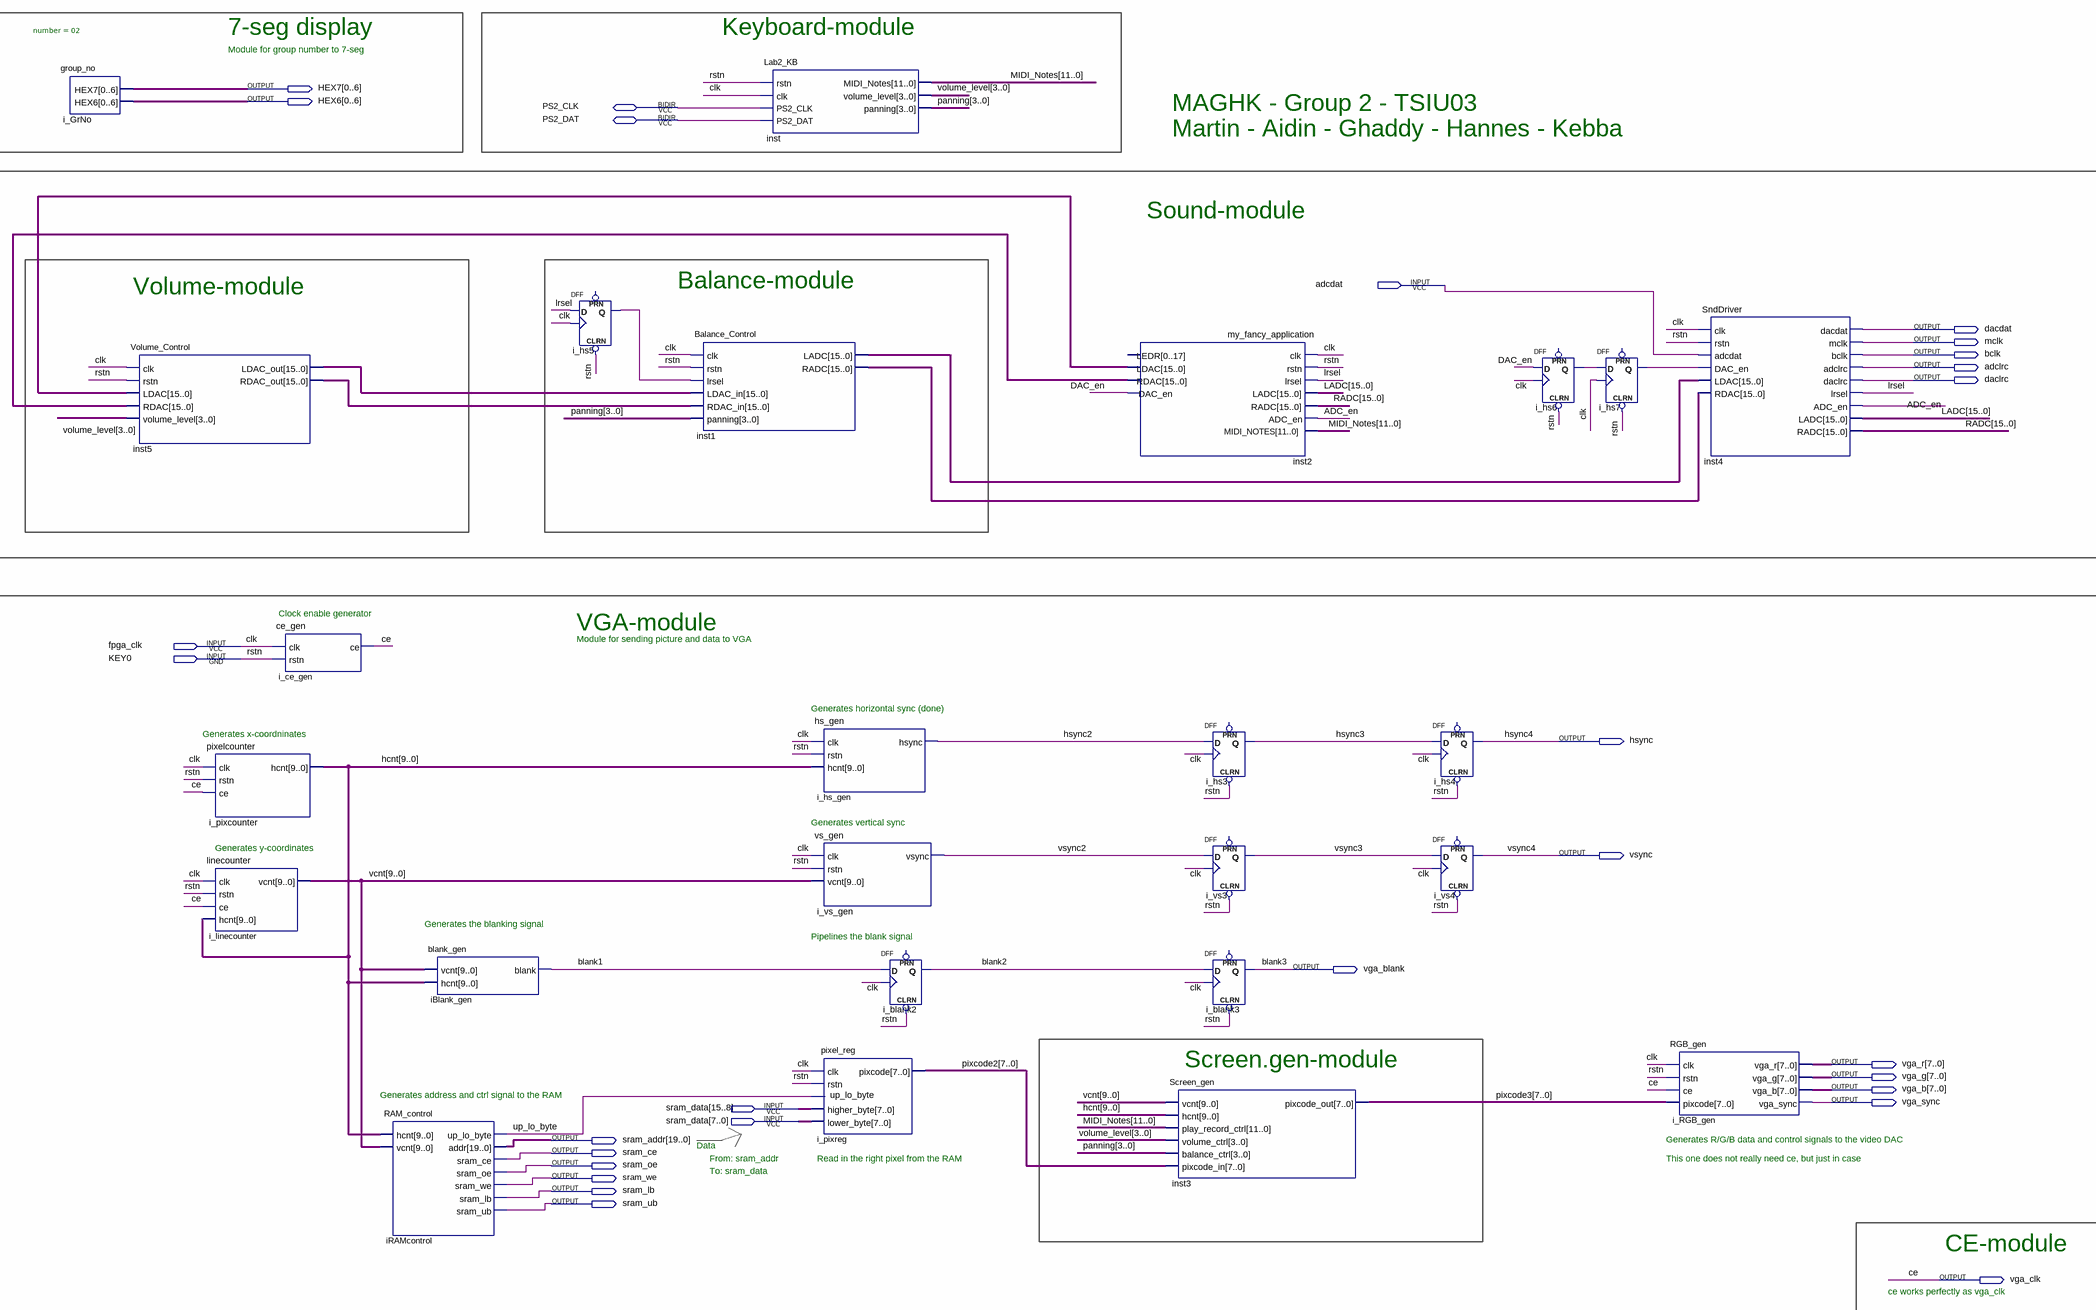
[diagram p0: schematic sheet]
// Quartus schematic VGA_contr.bdf as structural Verilog: 25 symbols, 28 pins
module VGA_contr (
  input  adcdat,
  input  fpga_clk,
  input  KEY0,
  input  [15:0] sram_data,
  inout  PS2_CLK,
  inout  PS2_DAT,
  output [0:6] HEX7,
  output [0:6] HEX6,
  output dacdat,
  output mclk,
  output bclk,
  output adclrc,
  output daclrc,
  output hsync,
  output vsync,
  output vga_blank,
  output [7:0] vga_r,
  output [7:0] vga_g,
  output [7:0] vga_b,
  output vga_sync,
  output [19:0] sram_addr,
  output sram_ce,
  output sram_oe,
  output sram_we,
  output sram_lb,
  output sram_ub,
  output vga_clk
);

  wire ADC_en, blank1, blank2, DAC_en, hsync2, hsync3, i_hs5_q, i_hs6_q, i_hs7_q, lrsel, up_lo_byte, vsync2,
       vsync3;
  wire [3:0] panning, volume_level;
  wire [7:0] pixcode2, pixcode3;
  wire [9:0] hcnt, vcnt;
  wire [11:0] MIDI_Notes;
  wire [15:0] inst1_ladc, inst1_radc, inst2_ldac, inst2_rdac, inst5_ldac_out, inst5_rdac_out, LADC, RADC;

  group_no #(.number(02)) i_GrNo (.HEX7(HEX7), .HEX6(HEX6));
  Volume_Control inst5 (
    .clk(fpga_clk), .rstn(KEY0), .LDAC(inst2_ldac), .RDAC(inst2_rdac), .volume_level(volume_level),
    .LDAC_out(inst5_ldac_out), .RDAC_out(inst5_rdac_out));
  pixelcounter i_pixcounter (.clk(fpga_clk), .rstn(KEY0), .ce(vga_clk), .hcnt(hcnt));
  linecounter i_linecounter (.clk(fpga_clk), .rstn(KEY0), .ce(vga_clk), .hcnt(hcnt), .vcnt(vcnt));
  ce_gen i_ce_gen (.clk(fpga_clk), .rstn(KEY0), .ce(vga_clk));
  RAM_control iRAMcontrol (
    .hcnt(hcnt), .vcnt(vcnt), .addr(sram_addr), .sram_ce(sram_ce), .sram_oe(sram_oe), .sram_we(sram_we),
    .sram_lb(sram_lb), .sram_ub(sram_ub), .up_lo_byte(up_lo_byte));
  blank_gen iBlank_gen (.vcnt(vcnt), .hcnt(hcnt), .blank(blank1));
  DFF i_hs5 (.CLRN(KEY0), .CLK(fpga_clk), .D(lrsel), .Q(i_hs5_q));  // open: PRN
  Balance_Control inst1 (
    .clk(fpga_clk), .rstn(KEY0), .lrsel(i_hs5_q), .LDAC_in(inst5_ldac_out), .RDAC_in(inst5_rdac_out),
    .panning(panning), .LADC(inst1_ladc), .RADC(inst1_radc));
  Lab2_KB inst (
    .rstn(KEY0), .clk(fpga_clk), .PS2_CLK(PS2_CLK), .PS2_DAT(PS2_DAT), .MIDI_Notes(MIDI_Notes),
    .volume_level(volume_level), .panning(panning));
  hs_gen i_hs_gen (.clk(fpga_clk), .rstn(KEY0), .hcnt(hcnt), .hsync(hsync2));
  vs_gen i_vs_gen (.clk(fpga_clk), .rstn(KEY0), .vcnt(vcnt), .vsync(vsync2));
  pixel_reg i_pixreg (
    .clk(fpga_clk), .rstn(KEY0), .up_lo_byte(up_lo_byte), .higher_byte(sram_data[15:8]),
    .lower_byte(sram_data[7:0]), .pixcode(pixcode2));
  DFF i_blank2 (.CLRN(KEY0), .CLK(fpga_clk), .D(blank1), .Q(blank2));  // open: PRN
  my_fancy_application inst2 (
    .clk(fpga_clk), .rstn(KEY0), .lrsel(lrsel), .LADC(LADC), .RADC(RADC), .ADC_en(ADC_en),
    .MIDI_NOTES(MIDI_Notes), .LDAC(inst2_ldac), .RDAC(inst2_rdac), .DAC_en(DAC_en));  // open: LEDR
  DFF i_hs3 (.CLRN(KEY0), .CLK(fpga_clk), .D(hsync2), .Q(hsync3));  // open: PRN
  DFF i_vs3 (.CLRN(KEY0), .CLK(fpga_clk), .D(vsync2), .Q(vsync3));  // open: PRN
  DFF i_blank3 (.CLRN(KEY0), .CLK(fpga_clk), .D(blank2), .Q(vga_blank));  // open: PRN
  Screen_gen inst3 (
    .vcnt(vcnt), .hcnt(hcnt), .play_record_ctrl(MIDI_Notes), .volume_ctrl(volume_level),
    .balance_ctrl(panning), .pixcode_in(pixcode2), .pixcode_out(pixcode3));
  DFF i_hs4 (.CLRN(KEY0), .CLK(fpga_clk), .D(hsync3), .Q(hsync));  // open: PRN
  DFF i_vs4 (.CLRN(KEY0), .CLK(fpga_clk), .D(vsync3), .Q(vsync));  // open: PRN
  DFF i_hs6 (.CLRN(KEY0), .CLK(fpga_clk), .D(DAC_en), .Q(i_hs6_q));  // open: PRN
  DFF i_hs7 (.CLRN(KEY0), .CLK(fpga_clk), .D(i_hs6_q), .Q(i_hs7_q));  // open: PRN
  RGB_gen i_RGB_gen (
    .clk(fpga_clk), .rstn(KEY0), .ce(vga_clk), .pixcode(pixcode3), .vga_r(vga_r), .vga_g(vga_g),
    .vga_b(vga_b), .vga_sync(vga_sync));
  SndDriver inst4 (
    .clk(fpga_clk), .rstn(KEY0), .adcdat(adcdat), .DAC_en(i_hs7_q), .LDAC(inst1_ladc), .RDAC(inst1_radc),
    .dacdat(dacdat), .mclk(mclk), .bclk(bclk), .adclrc(adclrc), .daclrc(daclrc), .lrsel(lrsel),
    .ADC_en(ADC_en), .LADC(LADC), .RADC(RADC));

  // Other names for the same wires on the sheet: blank3 = vga_blank; ce = vga_clk; clk = fpga_clk; hsync4 = hsync;
  //   rstn = KEY0; vsync4 = vsync

  // Notes on the sheet:
  //   7-seg display
  //   Keyboard-module
  //   Module for group number to 7-seg
  //   MAGHK - Group 2 - TSIU03
  //   Martin - Aidin - Ghaddy - Hannes - Kebba
  //   Sound-module
  //   Balance-module
  //   Volume-module
  //   Clock enable generator
  //   VGA-module
  //   Module for sending picture and data to VGA
  //   Generates horizontal sync (done)
  //   Generates x-coordninates
  //   Generates vertical sync
  //   Generates y-coordinates
  //   Generates the blanking signal
  //   Pipelines the blank signal
  //   Screen.gen-module
  //   Generates address and ctrl signal to the RAM
  //   Generates R/G/B data and control signals to the video DAC
  //   Data
  //   From: sram_addr
  //   Read in the right pixel from the RAM
  //   This one does not really need ce, but just in case
  //   To: sram_data
  //   CE-module
  //   ce works perfectly as vga_clk
endmodule
